# EasyEDA schematic SCH_OPM MegaMod_2021-11-01.json

## Sheets
1 MAIN: TITLE: Sheet_1; REV: 1.0; Date: 2021-10-25; Sheet: 1/1; Drawn By: Denjhang; Company: Your Company
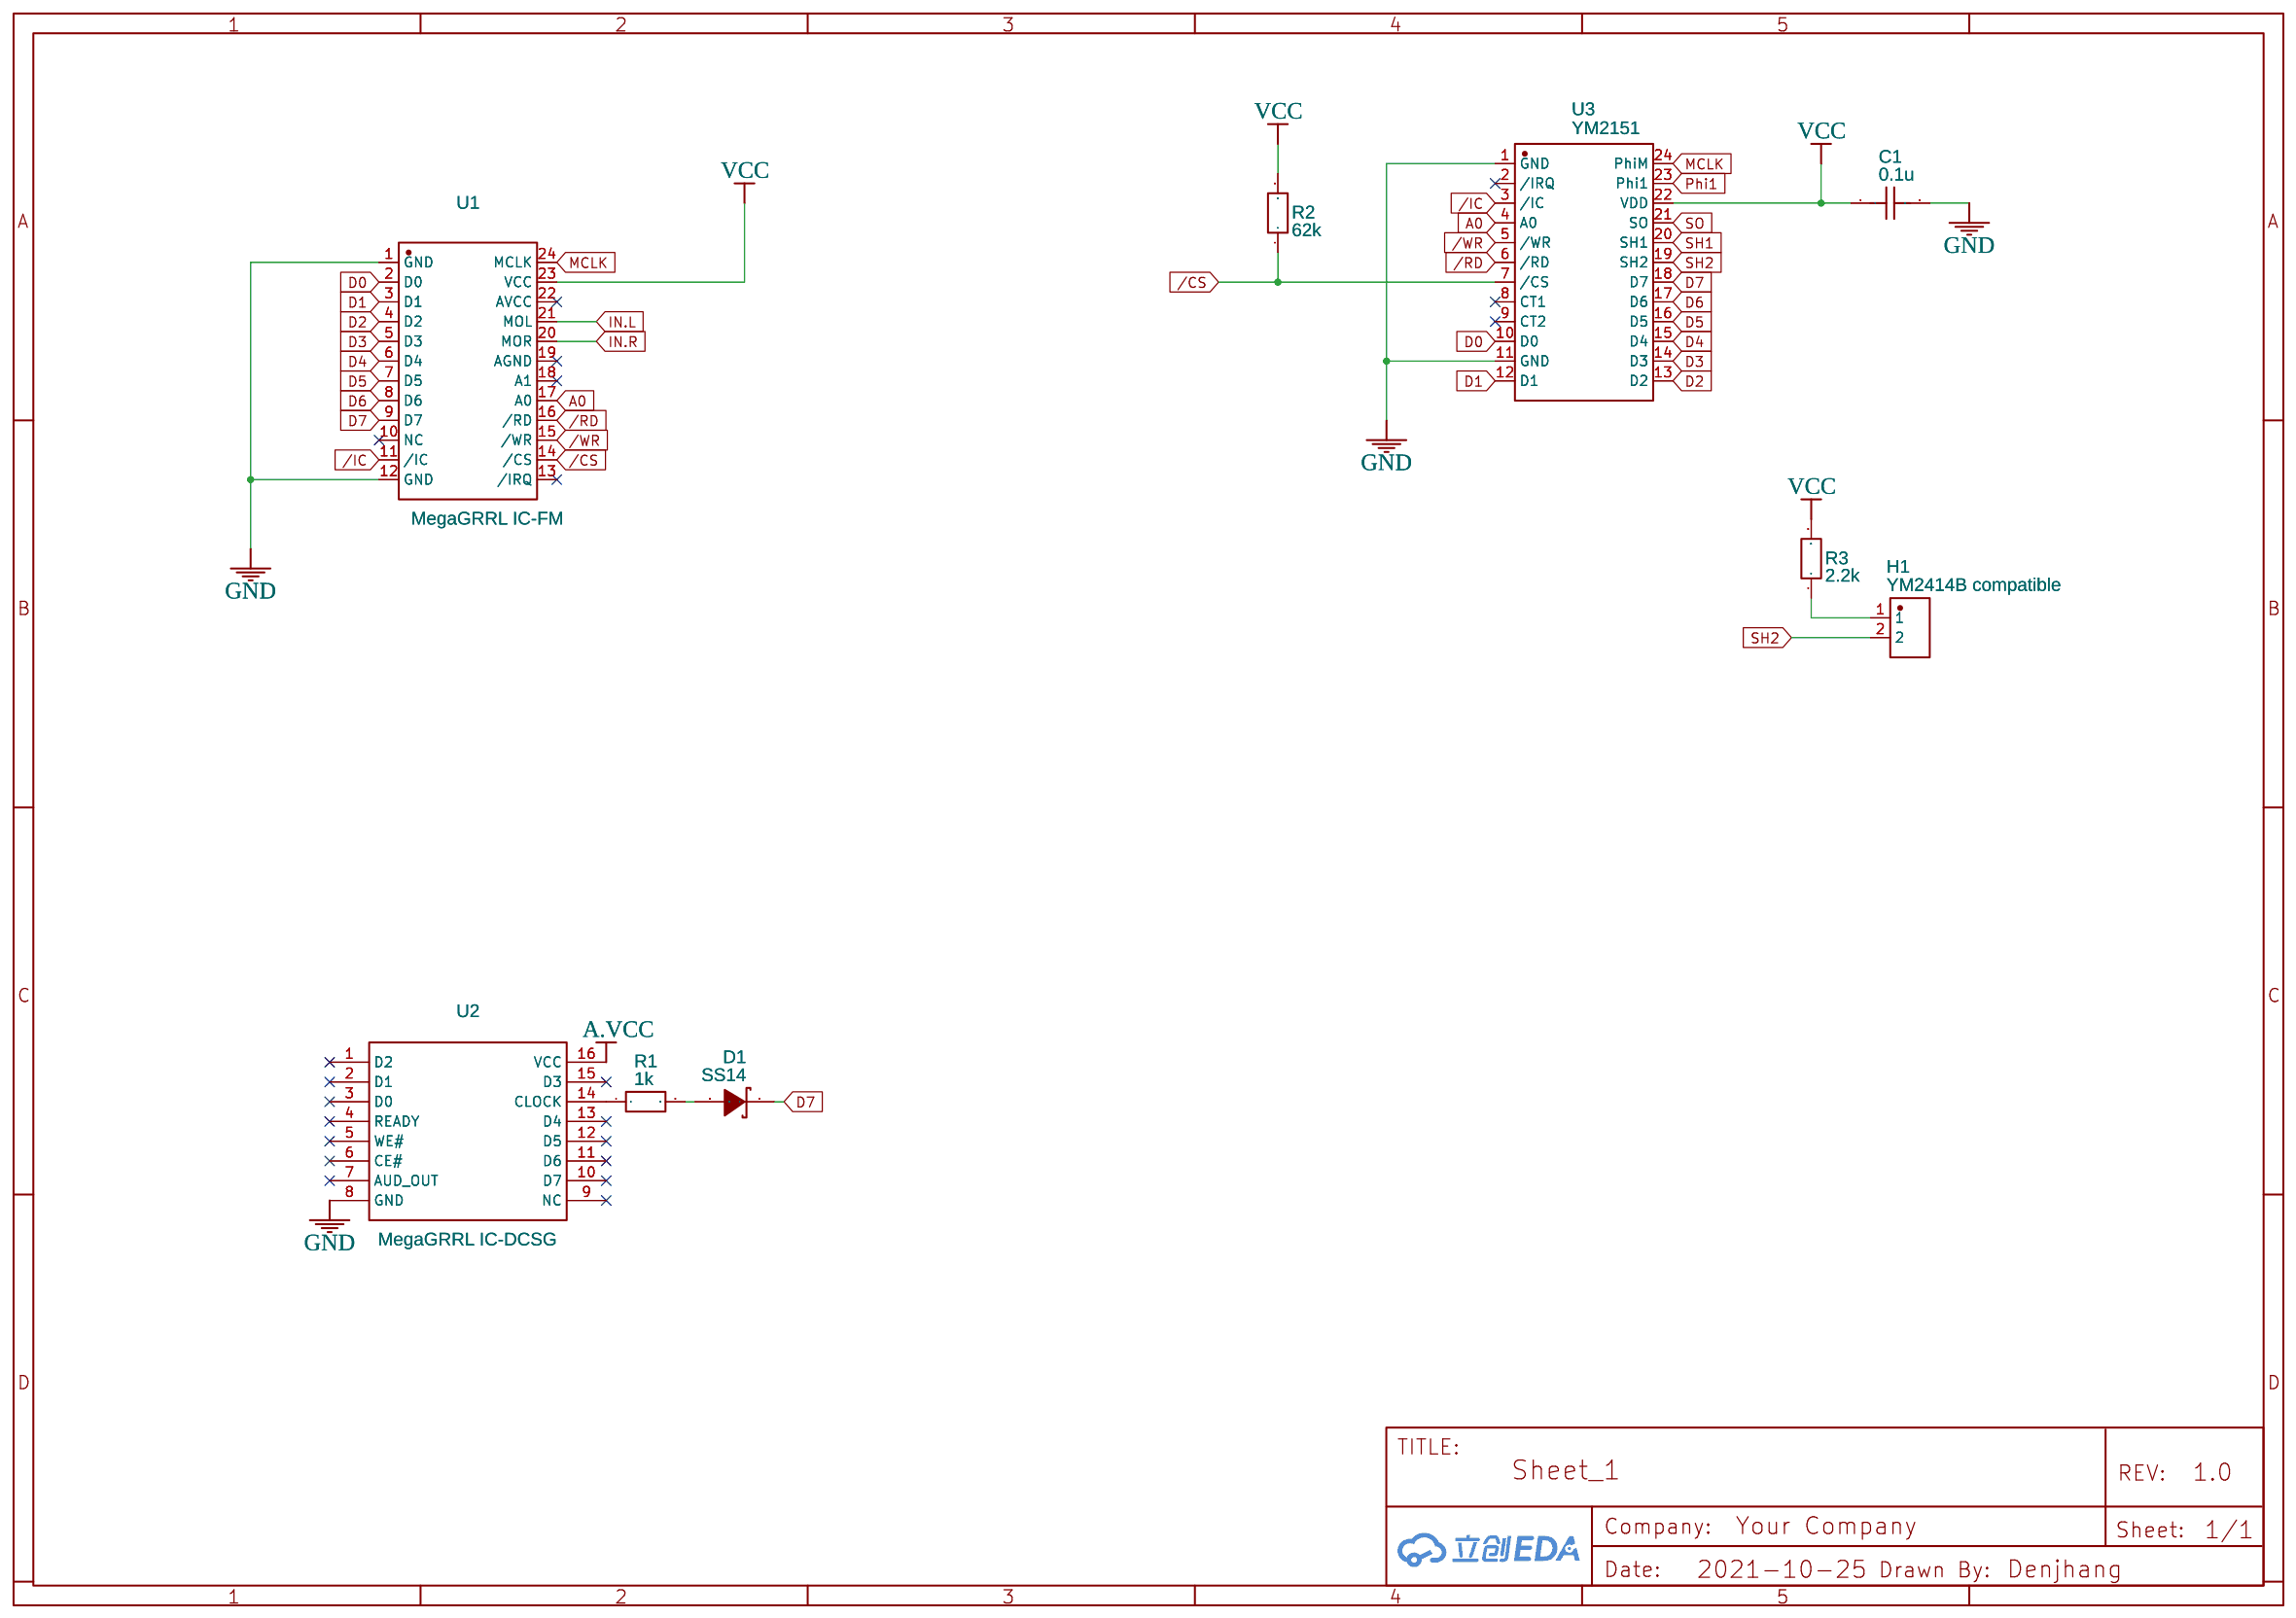
[diagram p0: MAIN]
2 DAC: Date: 2021-10-26
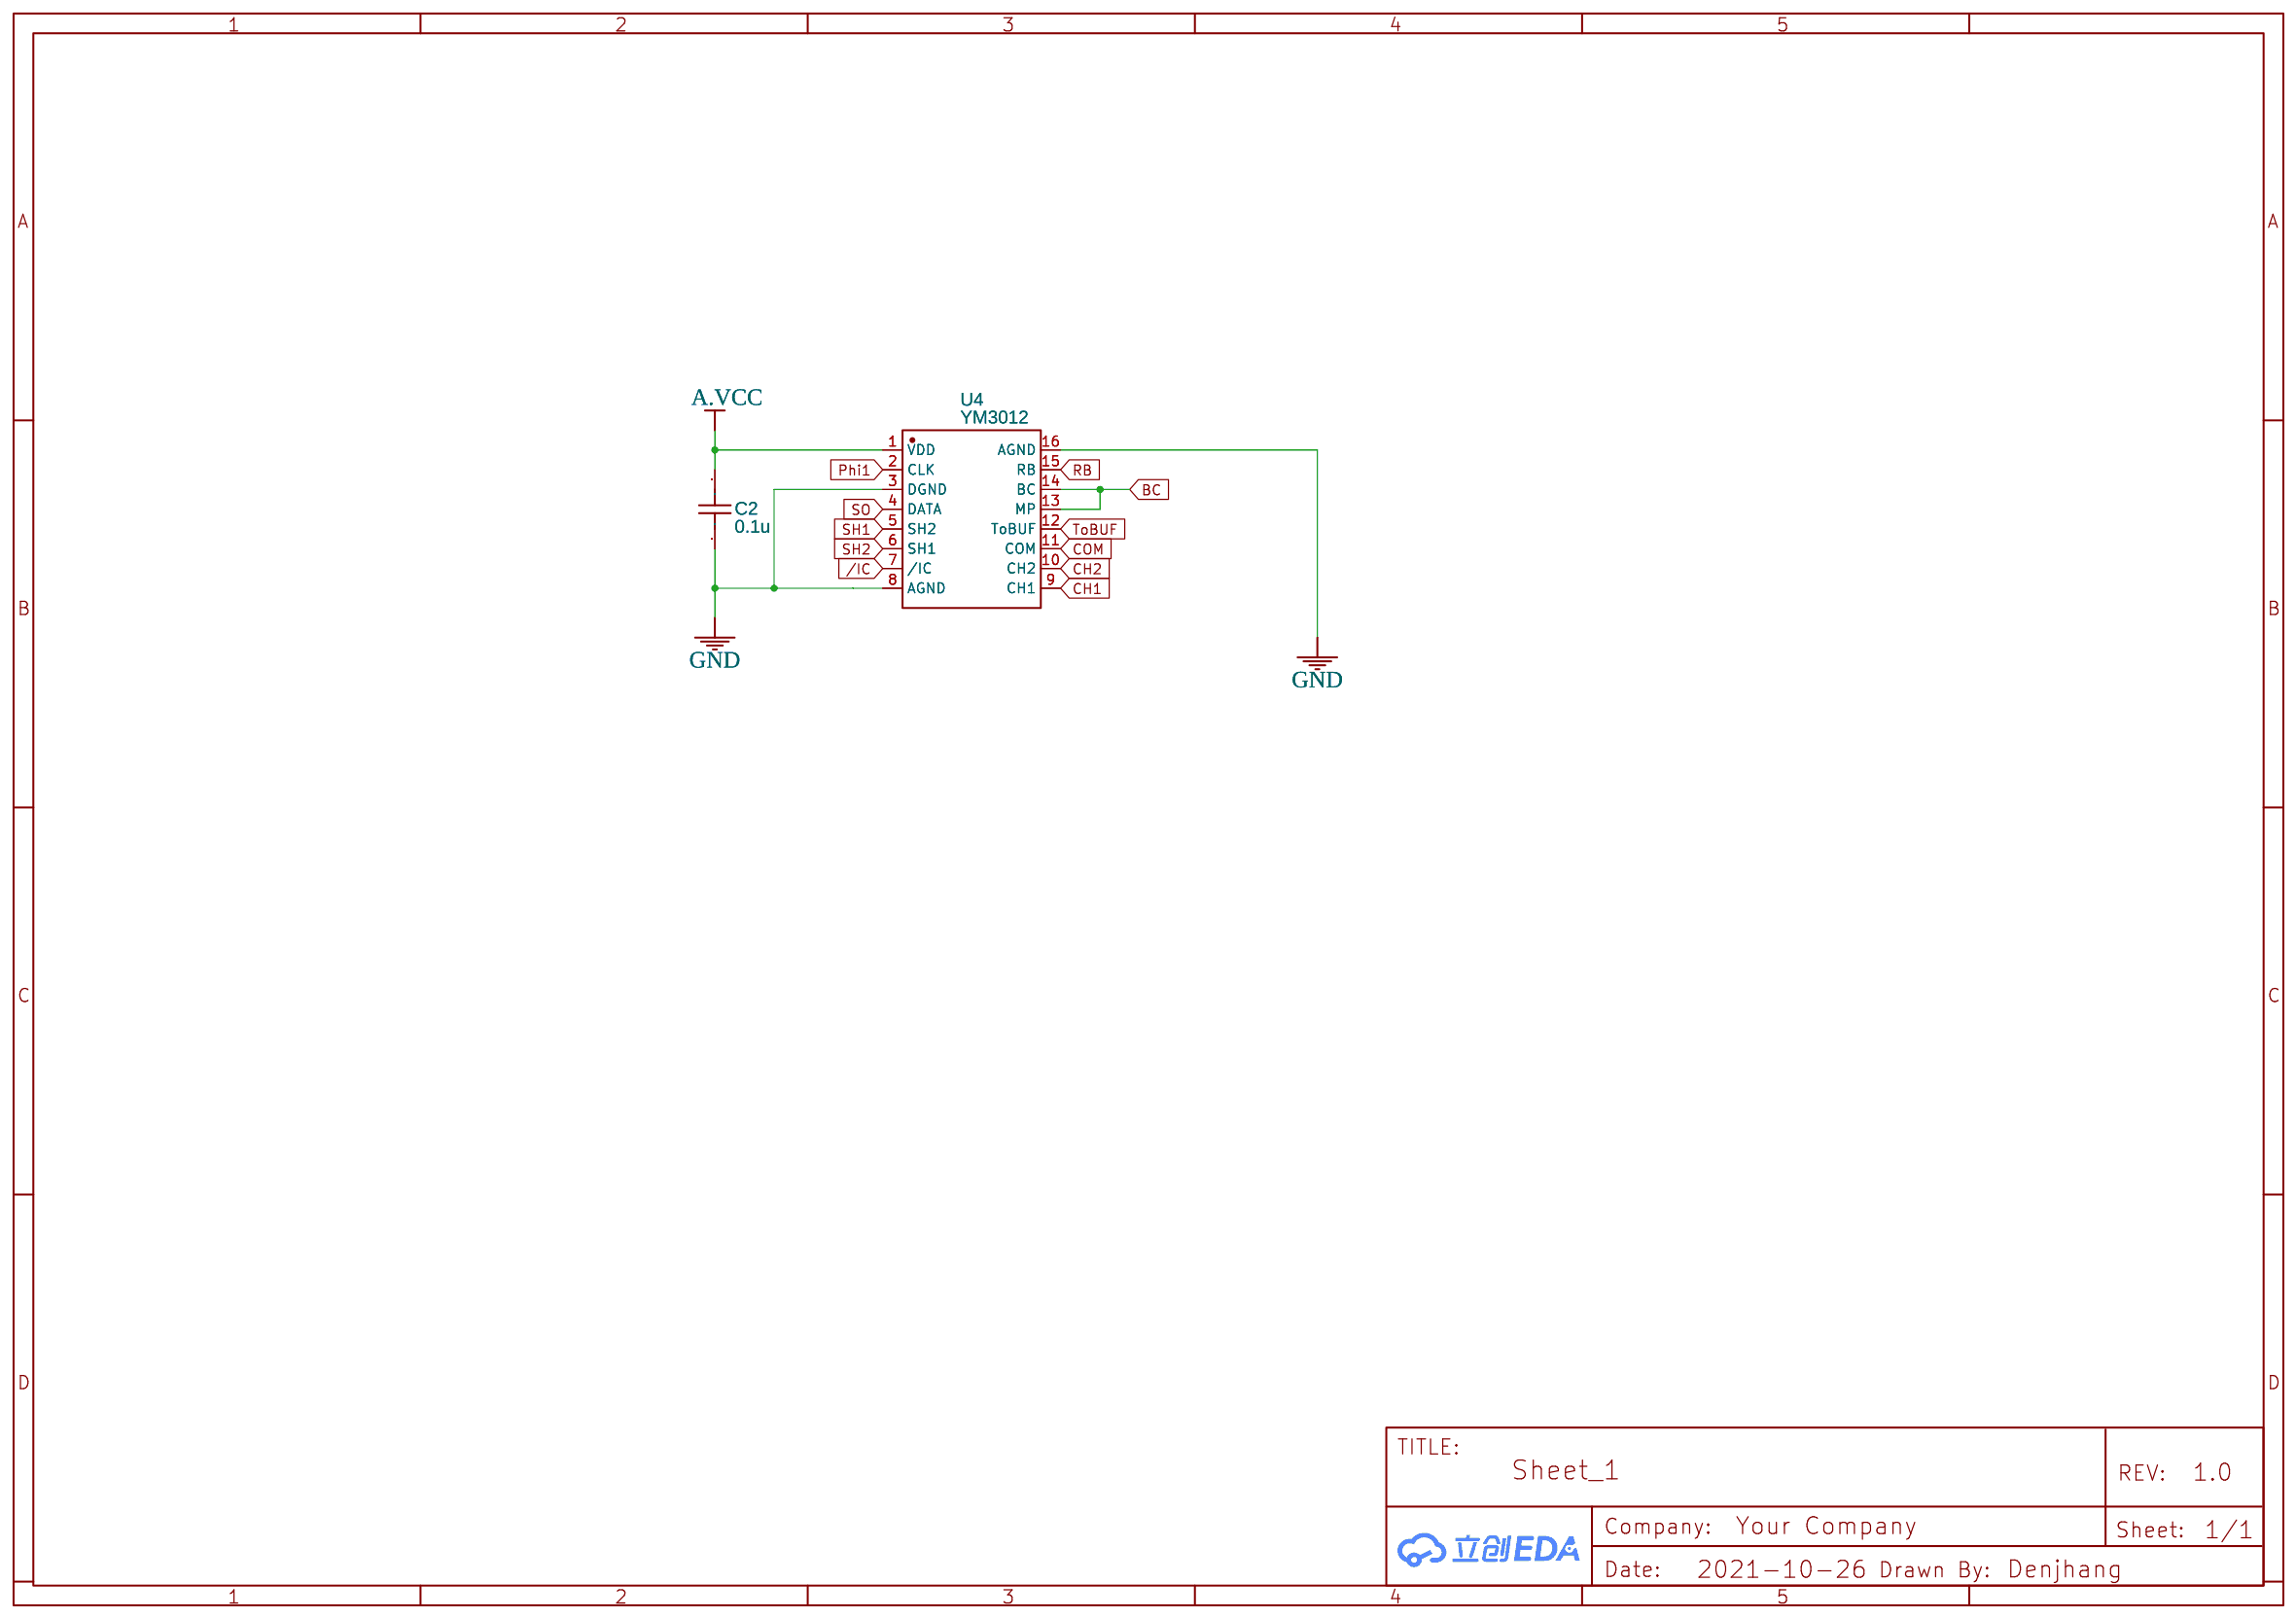
[diagram p1: DAC]
3 AMP1: Date: 2021-10-26
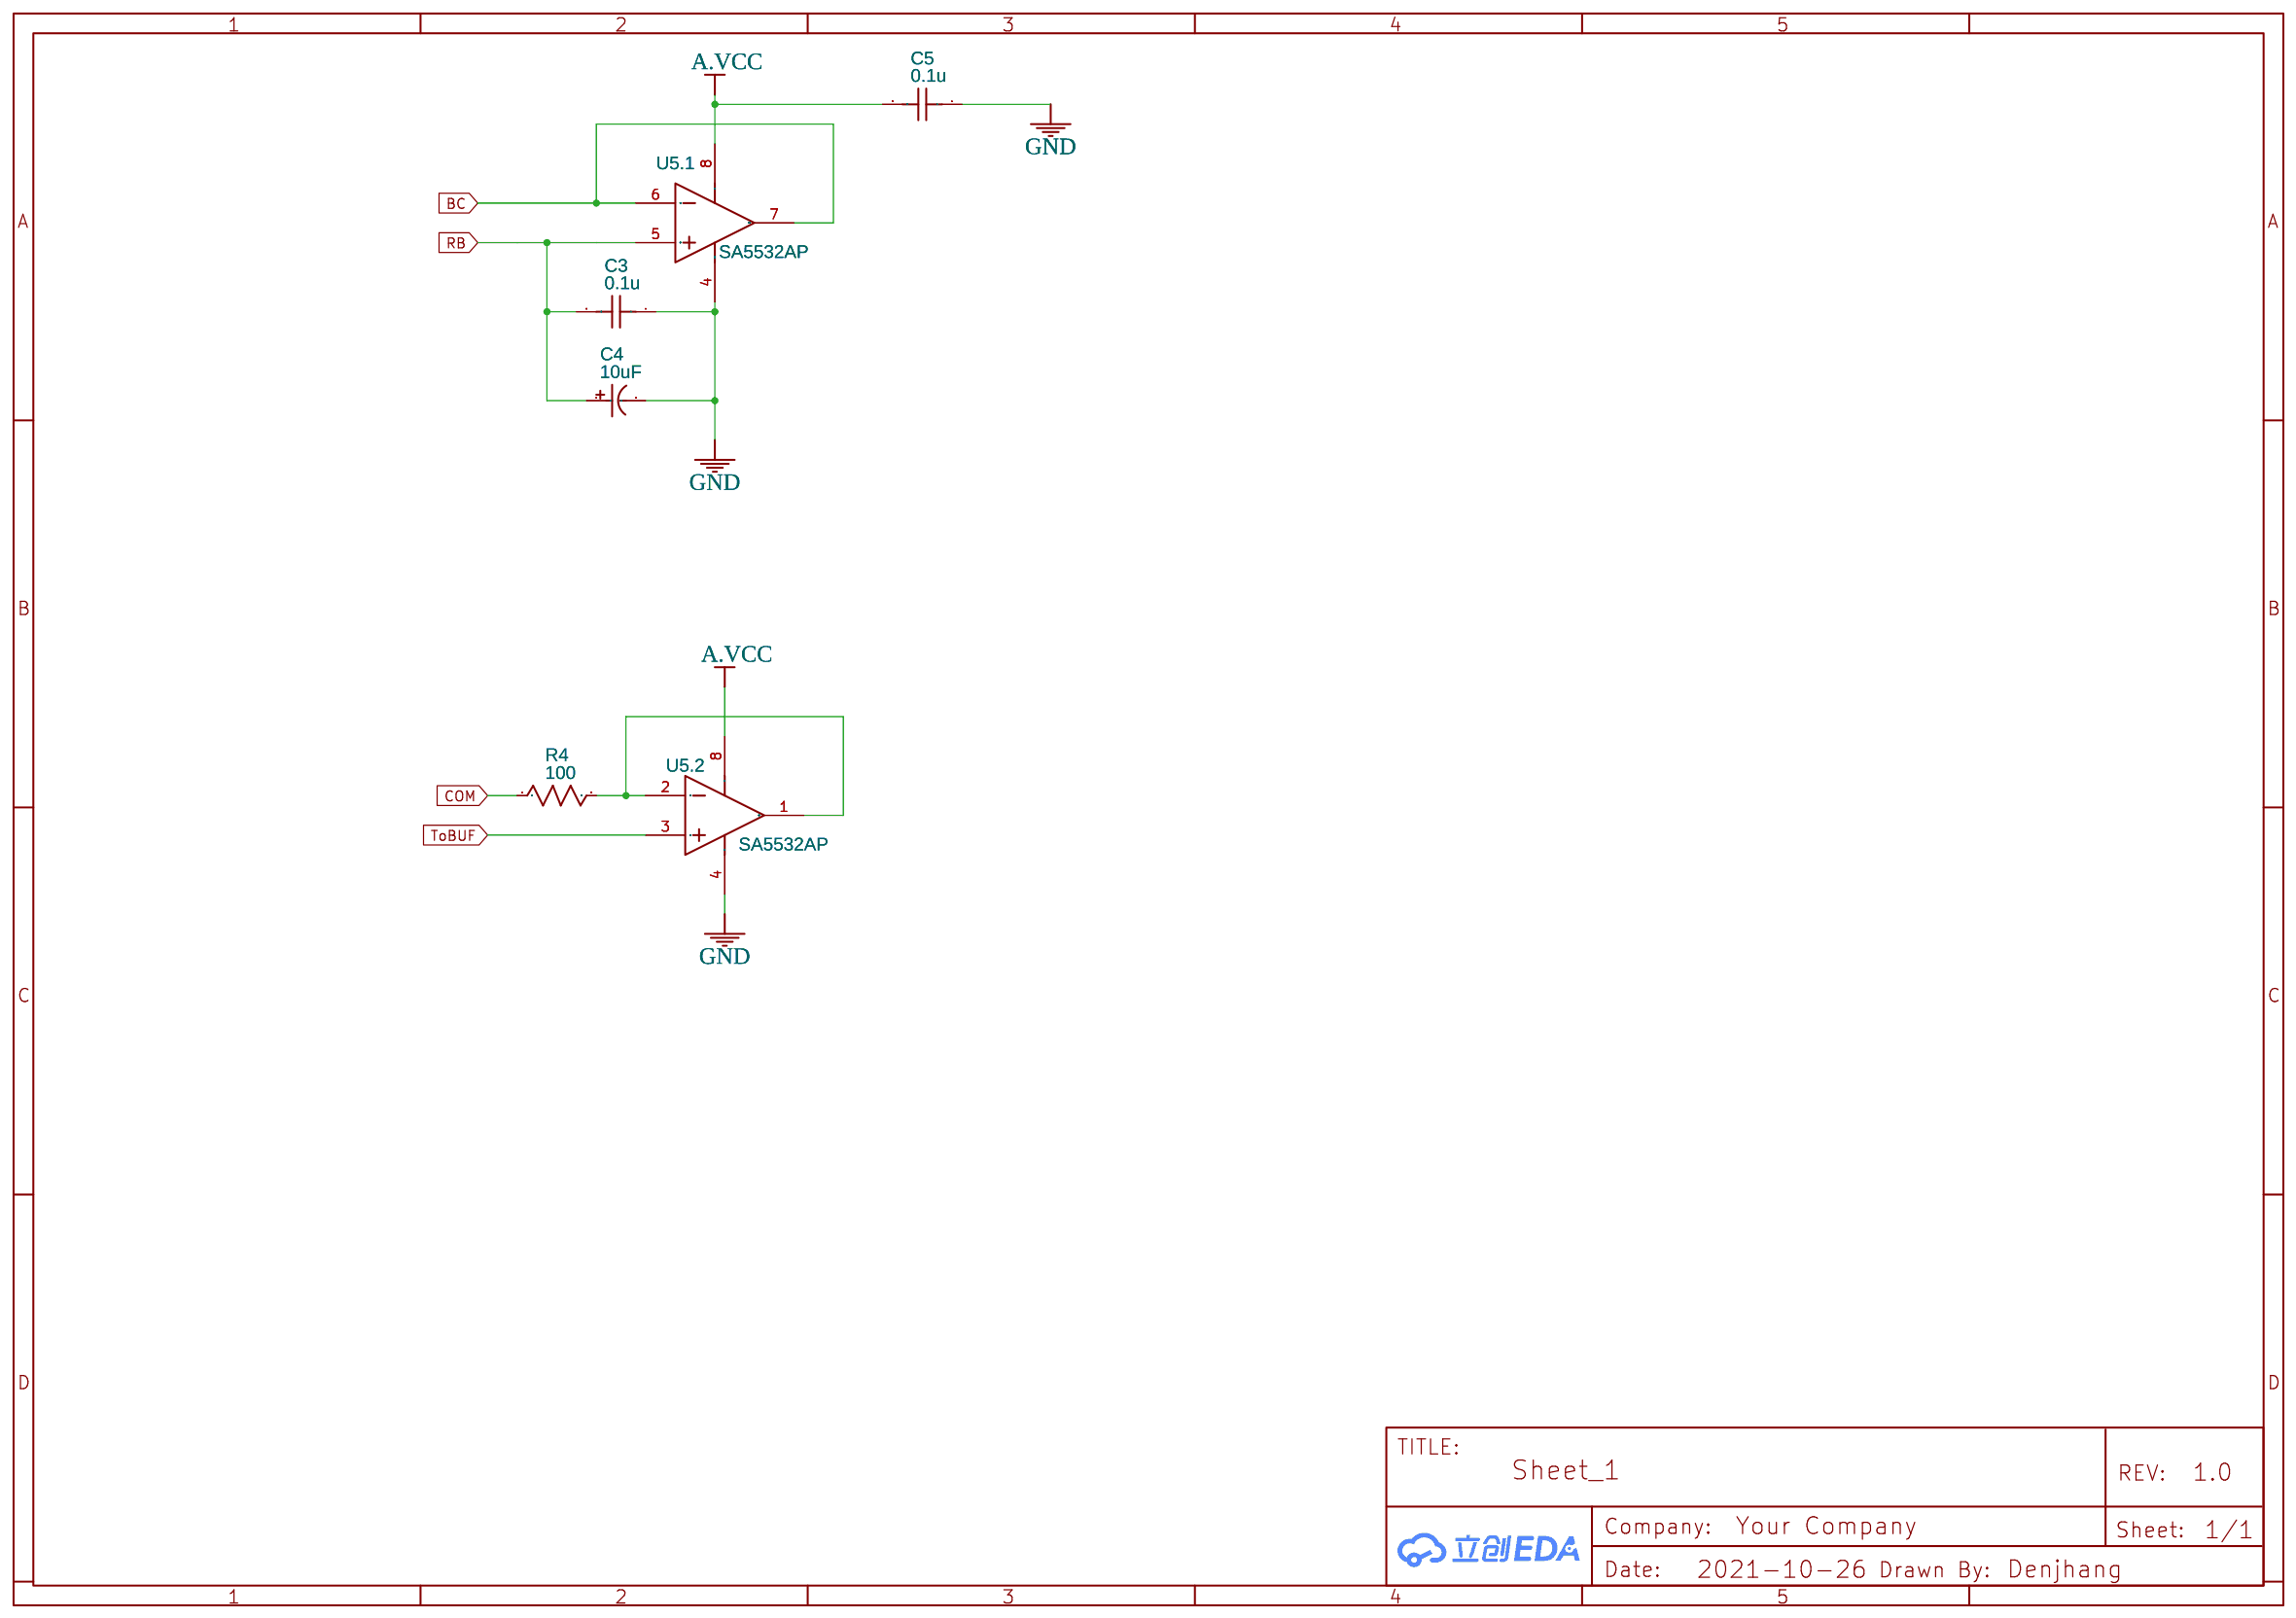
[diagram p2: AMP1]
4 AMP2: Date: 2021-10-26
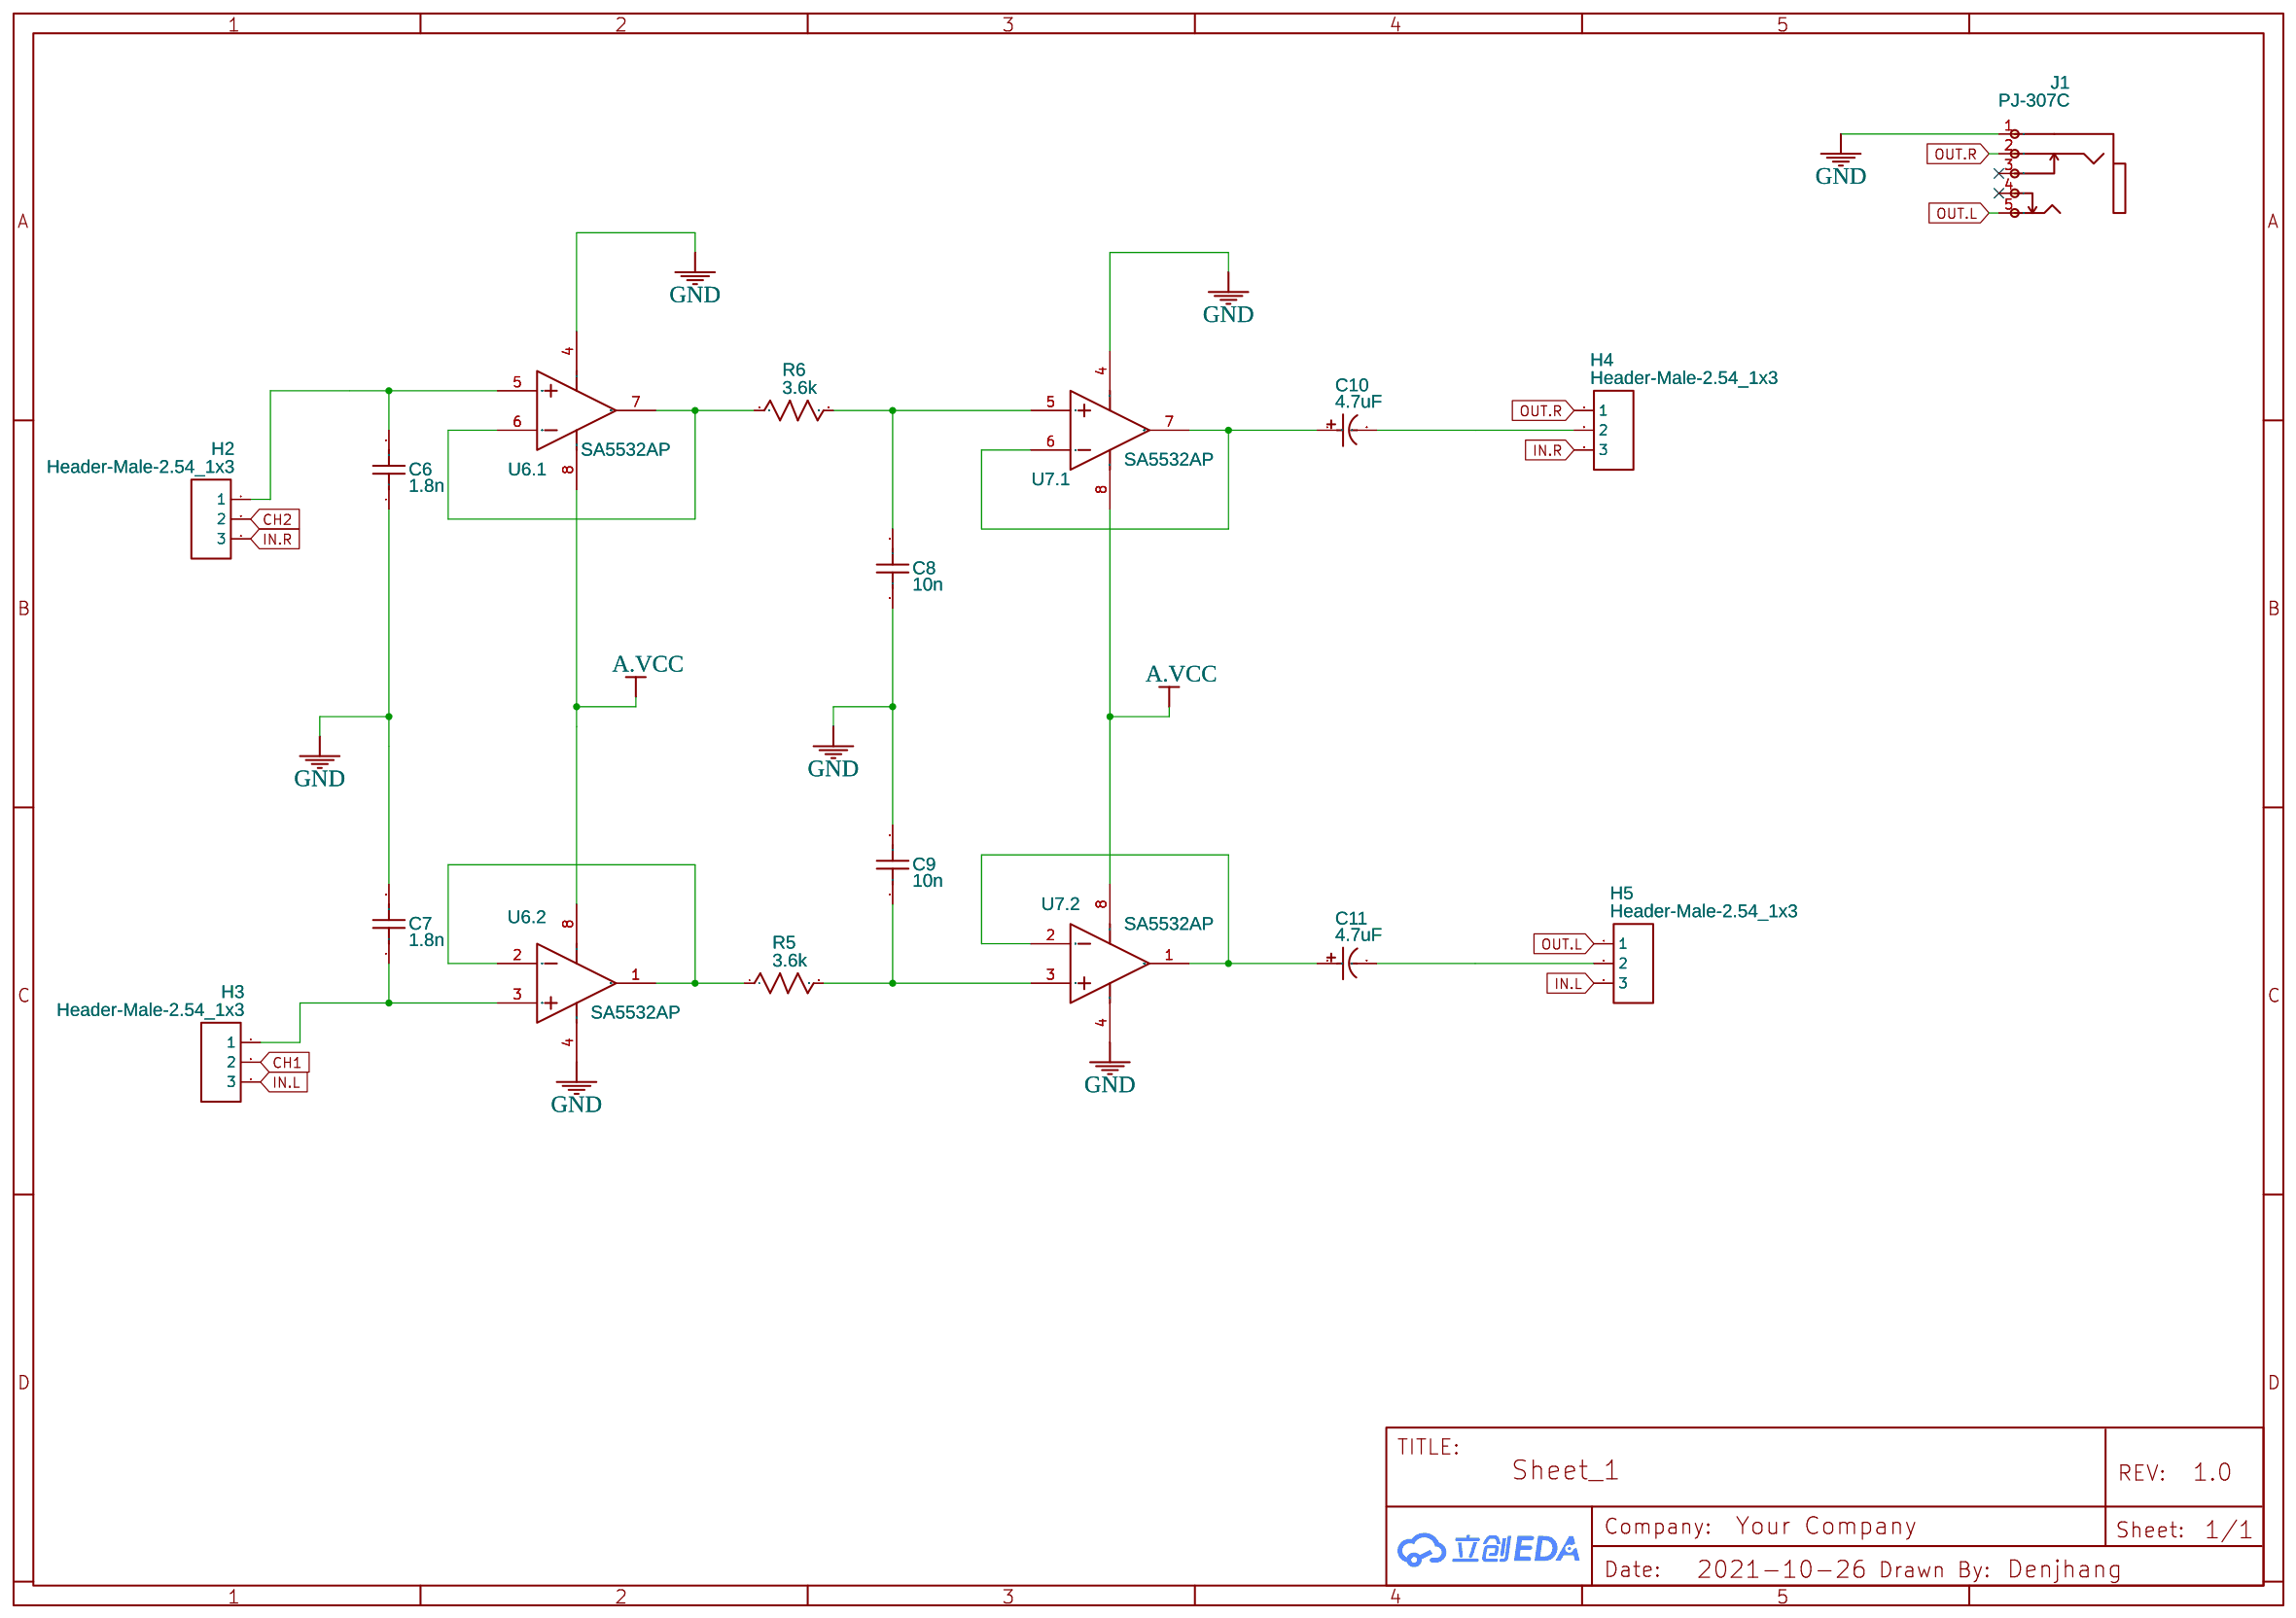
[diagram p3: AMP2]

## Parts
sheet AMP1
C3  0.1u  [C0603]
C4  10uF  [CAP-TH_BD6.3-P2.50-D1.0-FD]
C5  0.1u  [C0603]
R4  100  [R0603]
U5  SA5532AP  [DIP8]  (sections 1,2)
sheet AMP2
C6  1.8n  [C0603]
C7  1.8n  [C0603]
C8  10n  [C0603]
C9  10n  [C0603]
C10  4.7uF  [CAP-TH_BD6.3-P2.50-D1.0-FD]
C11  4.7uF  [CAP-TH_BD6.3-P2.50-D1.0-FD]
H2  Header-Male-2.54_1x3  [HDR-TH_3P-P2.54-V-M-1]
H3  Header-Male-2.54_1x3  [HDR-TH_3P-P2.54-V-M-1]
H4  Header-Male-2.54_1x3  [HDR-TH_3P-P2.54-V-M-1]
H5  Header-Male-2.54_1x3  [HDR-TH_3P-P2.54-V-M-1]
J1  PJ-307C  [AUDIO-TH_PJ307C]
R5  3.6k  [R0603]
R6  3.6k  [R0603]
U6  SA5532AP  [DIP8]  (sections 1,2)
U7  SA5532AP  [DIP8]  (sections 1,2)
sheet DAC
C2  0.1u  [C0603]
U4  YM3012  [DIP16]
sheet MAIN
C1  0.1u  [C0603]
D1  SS14  [SMA_L4.4-W2.8-LS5.4-RD]
H1  YM2414B compatible  [HDR-TH_2P-P2.54-V-M]
R1  1k  [R0603]
R2  62k  [R0603]
R3  2.2k  [R0603]
U1  MegaGRRL IC-FM  [DIP-24_L32.0-W13.8-P2.54-LS15.6-BL]
U2  MegaGRRL IC-DCSG  [DIP-16_L20.4-W5.8-P2.54-LS7.6-BL]
U3  YM2151  [DIP24-600]

## Library data of the parts
C1-C3 C5-C9 = C_0603_US: Contributor: LCEDA_Lib
C4 C10 C11 = 25V 47uF: Supplier: LCSC; Manufacturer: ValuePro; Manufacturer Part: 电解电容25V 47uF; Supplier Part: C45704; JLCPCB Part Class: Extended Part
R4-R6 = R_0603_US: Contributor: LCEDA_Lib
U5-U7 = SA5532AP: Dual Low-Noise Operational Amplifier, 10 to 30 V, -40 to 85 degC, 8-pin DIP (P8), Pb-Free (RoHS); subpart_no: 1
H2-H5 = Header-Male-2.54_1x3: Supplier: LCSC; Manufacturer: BOOMELE; Manufacturer Part: Header2.54mm 1*3P; Supplier Part: C49257; JLCPCB Part Class: Extended Part
J1 = PJ-307C: Supplier: LCSC; Manufacturer: BOOMELE; Supplier Part: C16684; JLCPCB Part Class: Extended Part
U4 = YM3012: Contributor: Denjhang
D1 = SS14: Supplier: LCSC; Manufacturer: MDD; Supplier Part: C2480; JLCPCB Part Class: Basic Part
H1 = KH-2.54PH180-1X2P-L11.5: Supplier: LCSC; Supplier Part: C2905434; Manufacturer: kinghelm(金航标); Contributor: LCSC
R1-R3 = R_0603_EU: Contributor: LCEDA_Lib
U1 = MegaGRRL IC-FM: Supplier Part: C707077; Manufacturer: YAMAHA; Manufacturer Part: YM2612; Contributor: Denjhang; JLCPCB SMD: Yes; SMT Type: Extend
U2 = SN76489AN: Manufacturer: Texas Instruments; Contributor: re1mu
U3 = YM2151: Contributor: Denjhang

## Nets
GND: C1.2 C2.1 C3.1 C4.2 C5.1 C6.1 C7.2 C8.1 C9.2 J1.1 U1.1(GND) U1.12(GND) U2.8(GND) U3.1(GND) U3.11(GND) U4.3(DGND) U4.8(AGND) U4.16(AGND) U5.4(VCC-) U6.4(VCC-) U7.4(VCC-)
VCC: C1.1 R2.2 R3.2 U1.23(VCC) U3.22(VDD)
/CS: R2.1 U1.14(/CS) U3.7(/CS)
/IC: U1.11(/IC) U3.3(/IC) U4.7(/IC)
/RD: U1.16(/RD) U3.6(/RD)
/WR: U1.15(/WR) U3.5(/WR)
A0: U1.17(A0) U3.4(A0)
A.VCC: C2.2 C5.2 U2.16(VCC) U4.1(VDD) U5.8(VCC+) U6.8(VCC+) U7.8(VCC+)
BC: U4.13(MP) U4.14(BC) U5.6(IN2-) U5.7(OUT2)
CH1: H3.2 U4.9(CH1)
CH2: H2.2 U4.10(CH2)
COM: R4.1 U4.11(COM)
D0: U1.2(D0) U3.10(D0)
D1: U1.3(D1) U3.12(D1)
D2: U1.4(D2) U3.13(D2)
D3: U1.5(D3) U3.14(D3)
D4: U1.6(D4) U3.15(D4)
D5: U1.7(D5) U3.16(D5)
D6: U1.8(D6) U3.17(D6)
D7: D1.1(K) U1.9(D7) U3.18(D7)
IN.L: H3.3 H5.3 U1.21(MOL)
IN.R: H2.3 H4.3 U1.20(MOR)
MCLK: U1.24(MCLK) U3.24(PhiM)
OUT.L: H5.1 J1.5
OUT.R: H4.1 J1.2
Phi1: U3.23(Phi1) U4.2(CLK)
RB: C3.2 C4.1 U4.15(RB) U5.5(IN2+)
SH1: U3.20(SH1) U4.5(SH2)
SH2: H1.2 U3.19(SH2) U4.6(SH1)
SO: U3.21(SO) U4.4(DATA)
ToBUF: U4.12(ToBUF) U5.3(IN1+)
Net-(C6-2): C6.2 H2.1 U6.5(IN2+)
Net-(C7-1): C7.1 H3.1 U6.3(IN1+)
Net-(C8-2): C8.2 R6.2 U7.5(IN2+)
Net-(C9-1): C9.1 R5.2 U7.3(IN1+)
Net-(C10-1): C10.1 U7.6(IN2-) U7.7(OUT2)
Net-(C10-2): C10.2 H4.2
Net-(C11-1): C11.1 U7.1(OUT1) U7.2(IN1-)
Net-(C11-2): C11.2 H5.2
Net-(D1-2): D1.2(A) R1.2
Net-(H1-1): H1.1 R3.1
Net-(R1-1): R1.1 U2.14(CLOCK)
Net-(R4-2): R4.2 U5.1(OUT1) U5.2(IN1-)
Net-(R5-1): R5.1 U6.1(OUT1) U6.2(IN1-)
Net-(R6-1): R6.1 U6.6(IN2-) U6.7(OUT2)

Not connected (* = marked no-connect by the designer): J1 3* 4*; U1 10(NC)* 13(/IRQ)* 18(A1)* 19(AGND)* 22(AVCC)*; U2 1(D2)* 2(D1)* 3(D0)* 4(READY)* 5(WE#)* 6(CE#)* 7(AUD OUT)* 9(NC)* 10(D7)* 11(D6)* 12(D5)* 13(D4)* 15(D3)*; U3 2(/IRQ)* 8(CT1)* 9(CT2)*
